# EAGLE design Leuchtende_Untertasse (EAGLE 6.2)
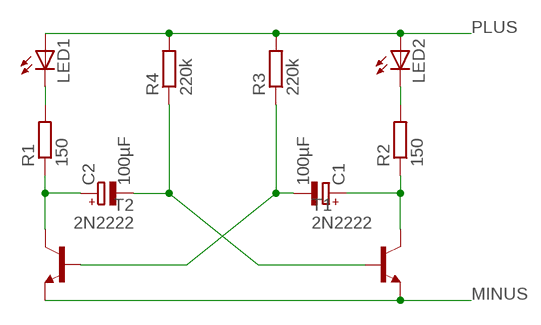
[diagram p0: schematic, sheet 1]

## Parts
C1  100µF  CPOL-EUE2.5-5  [E2,5-5]
C2  100µF  CPOL-EUE2.5-5  [E2,5-5]
LED1  LED5MM  [LED5MM]
LED2  LED5MM  [LED5MM]
R1  150  R-EU_0204/7  [0204/7]
R2  150  R-EU_0204/7  [0204/7]
R3  220k  R-EU_0204/7  [0204/7]
R4  220k  R-EU_0204/7  [0204/7]
T1  2N2222  [TO18]
T2  2N2222  [TO18]

## Nets
MINUS: T1.1(E) T2.1(E)
N$2: C2.+ R1.1 T2.3(C)
N$3: C1.+ R2.1 T1.3(C)
N$4: C1.- R3.1 T2.2(B)
N$5: C2.- R4.1 T1.2(B)
N$7: LED2.K(C) R2.2
N$8: LED1.K(C) R1.2
PLUS: LED1.A LED2.A R3.2 R4.2

## Library data of the parts
C1 C2 = resistor:CPOL-EU: POLARIZED CAPACITOR, European symbol
LED1 LED2 = led:LED: LED OSRAM: - CHIPLED LG R971, LG N971, LY N971, LG Q971, LY Q971, LO R971, LY R971 LH N974, LH R974 LS Q976, LO Q976, LY Q976 LO Q996 - Hyper CHIPLED LW Q18S LB Q993, LB Q99A, LB R99A - SideLED LS A670, LO A670, LY A670, LG A670, LP A670 LB A673, LV A673, LT A673, LW A673 LH A674 LY A675 LS A676, LA A676, LO A676, LY A676, LW A676 LS A679, LY A679, LG A679 - Hyper Micro SIDELED® LS Y876, LA Y876, LO Y876, LY Y876 LT Y87S - SmartLED LW L88C, LW L88S LB L89C, LB L89S, LG L890 LS L89K, LO L89K, LY L89K LS L896, LA L896, LO L896, LY L896 - TOPLED LS T670, LO T670, LY T670, LG T670, LP T670 LSG T670, LSP T670, LSY T670, LOP T670, LYG T670 LG T671, LOG T671, LSG T671 LB T673, LV T673, LT T673, LW T673 LH T674 LS T676, LA T676, LO T676, LY T676, LB T676, LH T676, LSB T676, LW T676 LB T67C, LV T67C, LT T67C, LS T67K, LO T67K, LY T67K, LW E67C LS E67B, LA E67B, LO E67B, LY E67B, LB E67C, LV E67C, LT E67C LW T67C LS T679, LY T679, LG T679 LS T770, LO T770, LY T770, LG T770, LP T770 LB T773, LV T773, LT T773, LW T773 LH T774 LS E675, LA E675, LY E675, LS T675 LS T776, LA T776, LO T776, LY T776, LB T776 LHGB T686 LT T68C, LB T68C - Hyper Mini TOPLED® LB M676 - Mini TOPLED Santana® LG M470 LS M47K, LO M47K, LY M47K Source: http://www.osram.convergy.de LUXEON: - LUMILED® LXK2-PW12-R00, LXK2-PW12-S00, LXK2-PW14-U00, LXK2-PW14-V00 LXK2-PM12-R00, LXK2-PM12-S00, LXK2-PM14-U00 LXK2-PE12-Q00, LXK2-PE12-R00, LXK2-PE12-S00, LXK2-PE14-T00, LXK2-PE14-U00 LXK2-PB12-K00, LXK2-PB12-L00, LXK2-PB12-M00, LXK2-PB14-N00, LXK2-PB14-P00, LXK2-PB14-Q00 LXK2-PR12-L00, LXK2-PR12-M00, LXK2-PR14-Q00, LXK2-PR14-R00 LXK2-PD12-Q00, LXK2-PD12-R00, LXK2-PD12-S00 LXK2-PH12-R00, LXK2-PH12-S00 LXK2-PL12-P00, LXK2-PL12-Q00, LXK2-PL12-R00 Source: www.luxeon.com KINGBRIGHT: KA-3528ASYC Source: www.kingbright.com
R1-R4 = resistor:R-EU_: RESISTOR, European symbol
T1 T2 = transistor:2N2222: NPN TRANSISTOR

## Board
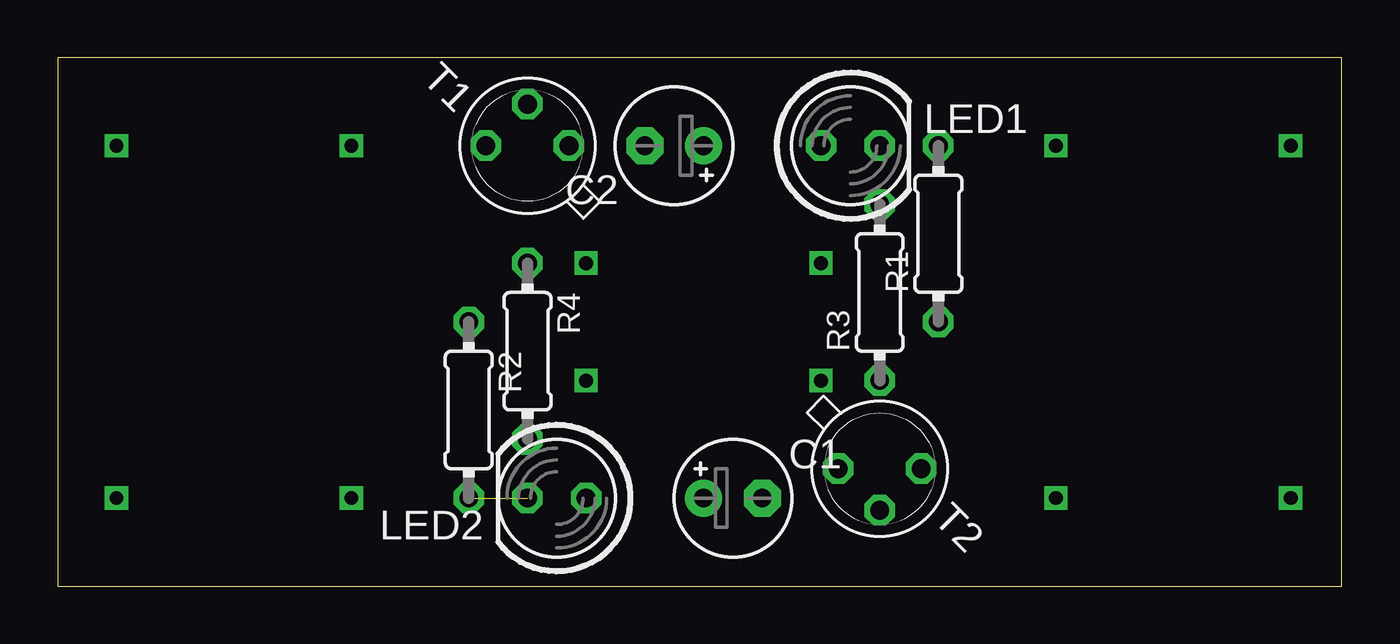
[diagram p1: board, top side]
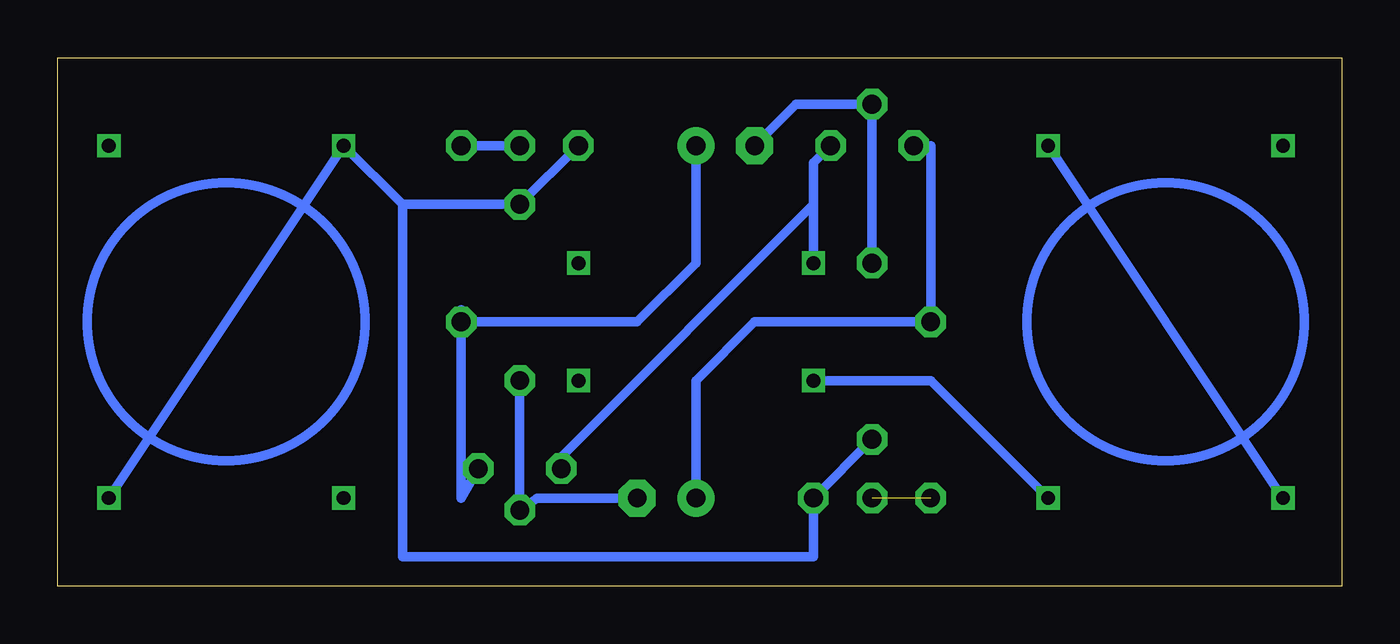
[diagram p2: board, bottom side, seen from below]

Size 55.55 x 22.85 mm. Coordinates in mm from the lower left corner, seen from the top.
Outline: 0,0 55.55,0 55.55,22.85 0,22.85 0,0
Copper layers (1*16): Top 0.035mm / dielectric 1.5mm / Bottom 0.035mm
Design rules: minimum track width 10mil, minimum drill 24mil, track to track 8mil, track to pad 8mil, pad to pad 8mil, via to via 8mil, smd to smd 8mil, copper to edge 40mil, drill to drill 8mil, minimum pad ring 10mil, minimum via ring 8mil, stop-mask expansion 4mil, vias tented up to drill 0mil, thermal gap 10mil

### Footprints (pad centres in the part's own frame; a part is rotated, then mirrored left to right if it is on the bottom)
E2,5-5 = drill 0.813 pad 1.6: + -1.27,0 | drill 0.813 pad 1.6 octagon: - 1.27,0
LED5MM = drill 0.813 octagon: A -1.27,0; K 1.27,0
0204/7 = drill 0.813 octagon: 1 -3.81,0; 2 3.81,0
TO18 = drill 0.813 octagon: 1 -1.27,-1.27; 2 1.27,-1.27; 3 1.27,1.27

### Placement (x,y rotation side)
C1  29.21,3.81 0 top
C2  26.67,19.05 180 top
LED1  34.29,19.05 0 top
LED2  21.59,3.81 180 top
R1  38.1,15.24 90 top
R2  17.78,7.62 270 top
R3  35.56,12.7 90 top
R4  20.32,10.16 270 top
T1  20.32,19.05 135 top
T2  35.56,5.08 315 top

### Tracks (layer width: path | path; a pad name or v marks a point on that pad's centre or on a via)
MINUS  (via drill 0.6)
  Bottom 0.406: T1.1 22.86,18.31 22.86,16.51 | 22.86,16.51 33.76,5.61 T2.1 | 22.86,16.51 v22.86,13.97
N$2
  Bottom 0.406: R1.1 38.1,11.96 | T2.3 38.1,3.81 R1.1 | C2.+ 27.94,13.97 30.48,11.43 R1.1
N$3
  Bottom 0.406: T1.3 17.78,19.05 R2.1 25.4,11.43 27.94,8.89 C1.+
N$4
  Bottom 0.406: C1.- 34.82,3.81 T2.2 R3.1
N$5
  Bottom 0.406: C2.- 23.6,20.85 T1.2 R4.1
N$7  (1 unrouted)
N$8
  Bottom 0.406: LED1.K R1.2
N$9  (via drill 0.6)
  Bottom 0.406: v22.86,8.89 17.78,8.89 v12.7,3.81
N$10  (via drill 0.6)
  other vias: 33.02,13.97
N$11  (via drill 0.6)
  other vias: 33.02,8.89
N$13  (via drill 0.6)
  other vias: 43.18,3.81
N$15  (via drill 0.6)
  other vias: 2.54,19.05
N$16  (via drill 0.6)
  Bottom 0.406: v12.7,19.05 v2.54,3.81
N$18  (via drill 0.6)
  other vias: 53.34,19.05
PLUS  (via drill 0.6)
  Bottom 0.406: LED1.A R3.2 40.64,16.51 | R4.2 LED2.A 22.86,1.27 40.64,1.27 40.64,16.51 | 40.64,16.51 v43.18,19.05 v53.34,3.81
(copper drawn outside any net)
  shapes: Bottom circle x3